# Altium schematic sheet Power Supply.SchDoc
size A4
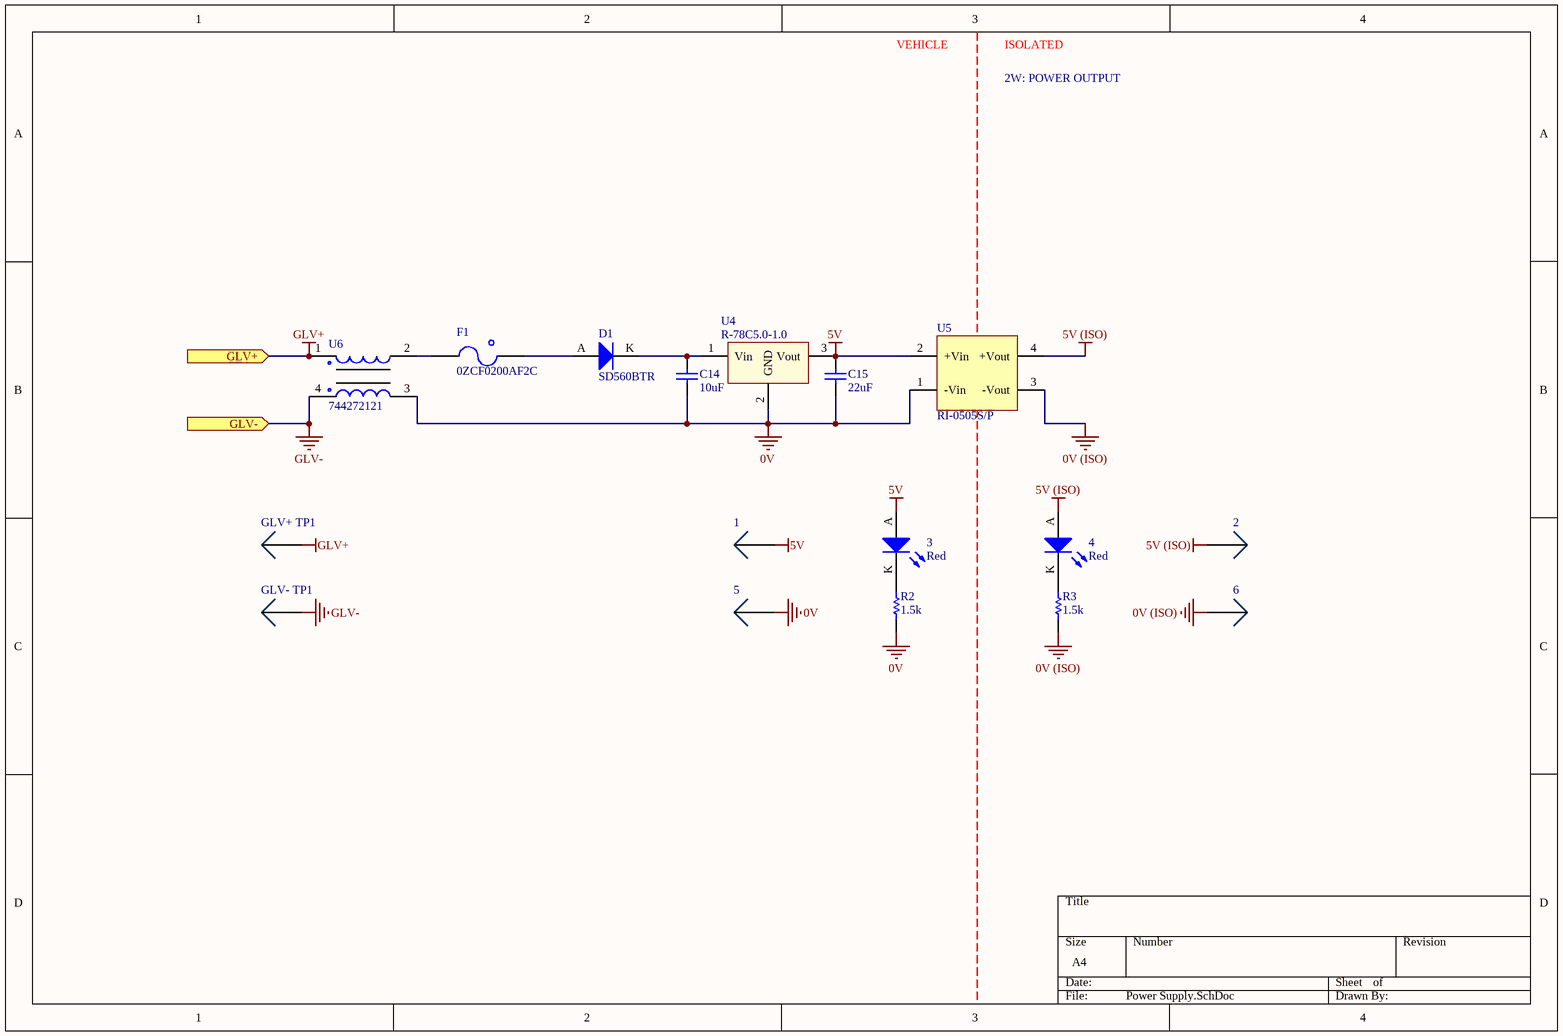
[diagram p0: Power Supply.SchDoc]

## Parts
1  0mm  [TH Test Point]  (value not drawn)
2  0mm  [TH Test Point]  (value not drawn)
3  Red  [0805 LED]
4  Red  [0805 LED]
5  0mm  [TH Test Point]  (value not drawn)
6  0mm  [TH Test Point]  (value not drawn)
C14  10uF  [0805]
C15  22uF  [0805]
D1  SD560BTR  [SMB Diode]
F1  0ZCF0200AF2C  [2920]
GLV+_TP1  0mm  [TH Test Point]  (value not drawn)
GLV-_TP1  0mm  [TH Test Point]  (value not drawn)
R2  1.5k  [0805]
R3  1.5k  [0805]
U4  R-78C5.0-1.0  [RECOM 3-SIP]
U5  RI-0505S/P  [RECOM 4-SIP]
U6  744272121  [INDC3216]

## Ports
GLV+ (in), GLV- (in)

## Nets
0V: 5.1 C14.1 C15.1 R2.1 U4.2(GND) U5.1(-Vin) U6.3
0V (ISO): 6.1 R3.1 U5.3(-Vout)
5V: 1.1 3.A C15.2 U4.3(Vout) U5.2(+Vin)
5V (ISO): 2.1 4.A U5.4(+Vout)
GLV+: GLV+_TP1.1 U6.1 ; port GLV+
GLV-: GLV-_TP1.1 U6.4 ; port GLV-
Net3_K: 3.K R2.2
Net4_K: 4.K R3.2
NetC14_2: C14.2 D1.K U4.1(Vin)
NetD1_A: D1.A F1.2
NetF1_1: F1.1 U6.2

## Notes on the sheet
- VEHICLE
- ISOLATED
- 2W: POWER OUTPUT

## Library data of the parts
1 2 5 6 GLV+_TP1 GLV-_TP1 = TH Test Point: Positions: 1; Angle: 0; Flange: No; Contact: NA; Part Number: TH Test Point; Pitch: 0mm; Row Spacing: 0mm
3 4 = SML-210LTT86: Red LED Indication - Discrete 1.75V 0805 (2012 Metric); Manufacturer: ROHM Semiconductor; Part Number: SML-210LTT86; Colour: Red; Digikey Part Number: 511-1286-1-ND; Digikey Link: https://www.digikey.com/product-detail/en/rohm-semiconductor/SML-210LTT86/511-1286-1-ND/637099
C14 = GRM21BR6YA106KE43L: Manufacturer: muRata; Tolerance: 10%; Material: X5R; Rated Voltage: 50V; Value: 10uF; Digikey Part Number: 490-10514-6-ND; Part Number: GRM21BR6YA106KE43L
C15 = GRM21BR61A226ME51L: Manufacturer: muRata; Tolerance: 20%; Material: X5R; Rated Voltage: 10V; Value: 22uF; Digikey Part Number: 490-10511-1-ND; Part Number: GRM21BR61A226ME51L
D1 = SD560BTR: 1.2V_F 600V 5A SMB; Manufacturer: SMC Diode Solutions; Part Number: SD560BTR; Digikey Part Number: 1655-1530-2-ND; Digikey Link: https://www.digikey.com/product-detail/en/smc-diode-solutions/SD560BTR/1655-1530-2-ND/6022620
F1 = 0ZCF0200AF2C: SMD 24V 2A Fuse; Manufacturer: Bel Fuse Inc; Part Number: 0ZCF0200AF2C; Digikey Part Number: 507-1749-2-ND; Digikey Link: https://www.digikey.com/product-detail/en/bel-fuse-inc/0ZCF0200AF2C/507-1749-2-ND/4156090
R2 R3 = RC0805FR071K5L: Manufacturer: YAGEO; Tolerance: 0.01; Rated Voltage: 0.125W; Part Number: RC0805FR071K5L; Value: 1.5k; Material: FR-07
U4 = R-78C5.0-1.0: CONV DC/DC 1A 5V OUT SIP VERT; Manufacturer: Recom; Part Number: R-78C5.0-1.0; Digikey Part Number: 945-1395-5-ND; Digikey Link: https://www.digikey.com.au/product-detail/en/recom-power/R-78C5.0-1.0/945-1395-5-ND/2652148
U5 = RI-0505S/P: 5V DC-DC Converter (2W) (Short circuit protected); Manufacturer: Recom; Input Voltage: 4.5V; Output Voltage: 5.5V; Efficiency: 0.83; Isolation: Isolated; Part Number: RI-0505S/P; Output Power: 5V; Digikey Part Number: 945-1499-5-ND; Digikey Link: https://www.digikey.com/product-detail/en/recom-power/RI-0505S-P/945-1499-5-ND/2314368
U6 = 744272121: Common Mode Choke 120UH 2.5A 2LN 460 OHM SMD; Manufacturer: Wurth Electronics Inc; Part Number: 744272121; Digikey Part Number: 732-1489-2-ND; Digikey Link: https://www.digikey.com/product-detail/en/wurth-electronics-inc/744272121/732-1489-2-ND/1638893